# EAGLE design CTS_Teensy_Board_v1_1 (EAGLE 9.4.2)
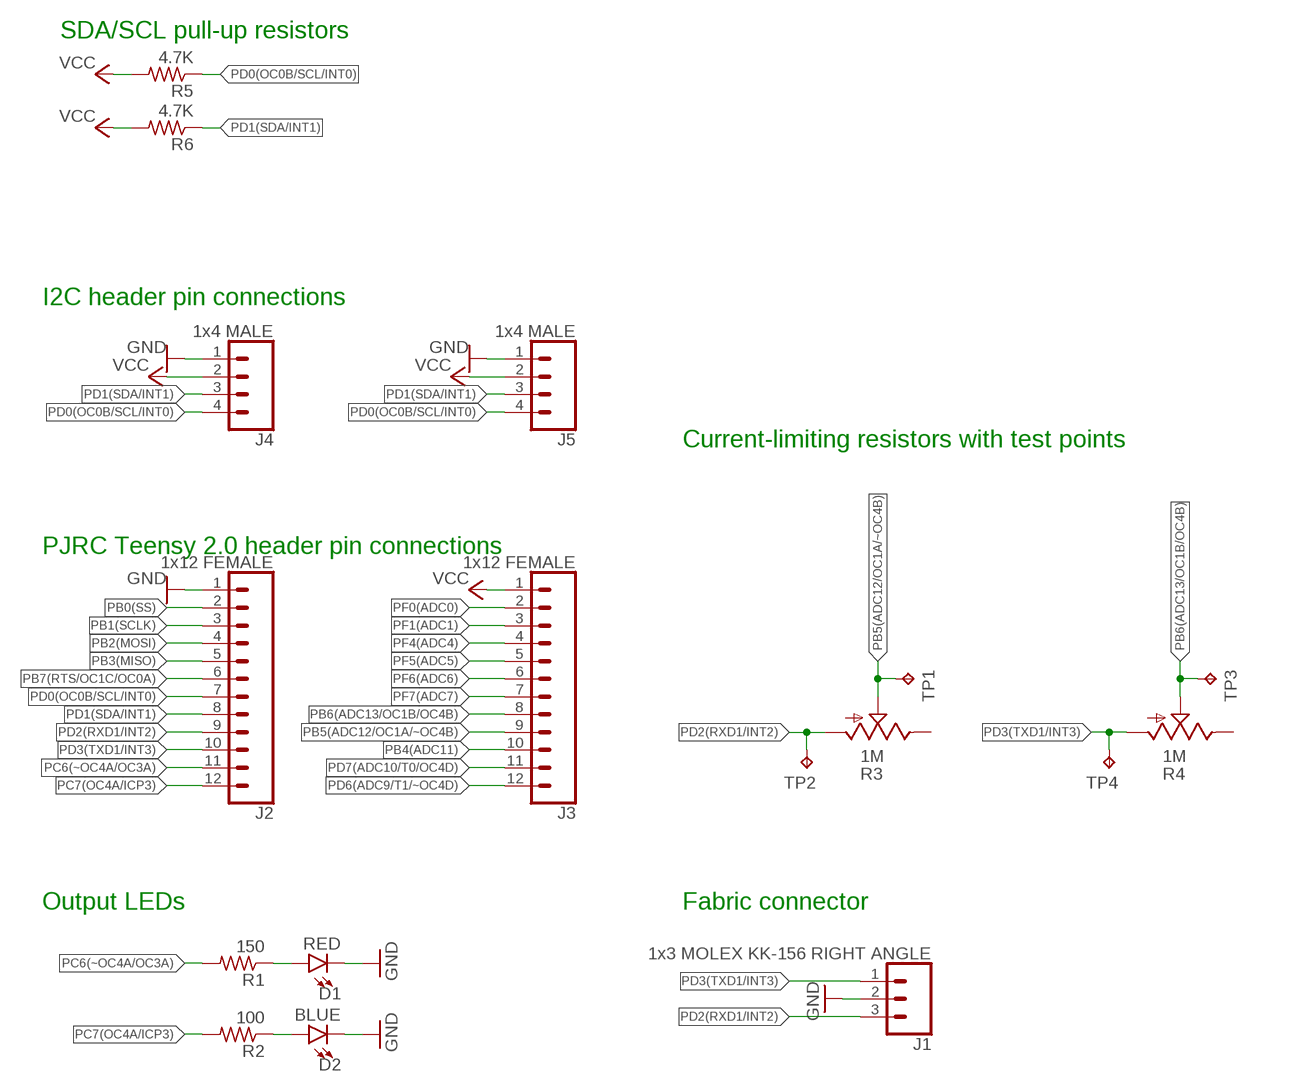
[diagram p0: schematic, sheet 1]

## Parts
D1  RED  LED3MM  [LED_3MM]
D2  BLUE  LED3MM  [LED_3MM]
J1  1x3 MOLEX KK-156 RIGHT ANGLE  CONN_03POLAR  [MOLEX-1X3]
J2  1x12 FEMALE  CONN_12  [1X12]
J3  1x12 FEMALE  CONN_12  [1X12]
J4  1x4 MALE  CONN_04  [1X04]
J5  1x4 MALE  CONN_04  [1X04]
R1  150  R-US_0204/7  [0204/7]
R2  100  R-US_0204/7  [0204/7]
R3  1M  TRIM_US-B90P  [SP19L]
R4  1M  TRIM_US-B90P  [SP19L]
R5  4.7K  R-US_0204/7  [0204/7]
R6  4.7K  R-US_0204/7  [0204/7]
TP1  TPTP18R  [TP18R]
TP2  TPTP18R  [TP18R]
TP3  TPTP18R  [TP18R]
TP4  TPTP18R  [TP18R]

## Nets
GND: D1.K(C) D2.K(C) J1.2 J2.1 J4.1 J5.1
N$31: D2.A R2.1
N$32: D1.A R1.1
PB0(SS): J2.2
PB1(SCLK): J2.3
PB2(MOSI): J2.4
PB3(MISO): J2.5
PB4(ADC11): J3.10
PB5(ADC12/OC1A/~OC4B): J3.9 R3.S TP1.TP
PB6(ADC13/OC1B/OC4B): J3.8 R4.S TP3.TP
PB7(RTS/OC1C/OC0A): J2.6
PC6(~OC4A/OC3A): J2.11 R1.2
PC7(OC4A/ICP3): J2.12 R2.2
PD0(OC0B/SCL/INT0): J2.7 J4.4 J5.4 R5.1
PD1(SDA/INT1): J2.8 J4.3 J5.3 R6.1
PD2(RXD1/INT2): J1.3 J2.9 R3.A TP2.TP
PD3(TXD1/INT3): J1.1 J2.10 R4.A TP4.TP
PD6(ADC9/T1/~OC4D): J3.12
PD7(ADC10/T0/OC4D): J3.11
PF0(ADC0): J3.2
PF1(ADC1): J3.3
PF4(ADC4): J3.4
PF5(ADC5): J3.5
PF6(ADC6): J3.6
PF7(ADC7): J3.7
VCC: J3.1 J4.2 J5.2 R5.2 R6.2
Unconnected: R3.E R4.E

## Notes on the sheet
- SDA/SCL pull-up resistors
- I2C header pin connections
- Current-limiting resistors with test points
- PJRC Teensy 2.0 header pin connections
- Output LEDs | Fabric connector

## Library data of the parts
D1 D2 = SparkFun-LED:LED: LED (Generic) Standard schematic elements and footprints for 5mm, 3mm, 1206, and 0603 sized LEDs. Generic LEDs with no color specified.; PROD_ID: DIO-08794
J1 = SparkFun-Connectors:CONN_03: Multi connection point. Often used as Generic Header-pin footprint for 0.1 inch spaced/style header connections On any of the 0.1 inch spaced packages, you can populate with these: Break Away Headers - Straight <https://www.sparkfun.com/products/116> (PRT-00116) Break Away Male Headers - Right Angle <https://www.sparkfun.com/products/553> (PRT-00553) Female Headers <https://www.sparkfun.com/products/115> (PRT-00115) Break Away Headers - Machine Pin <https://www.sparkfun.com/products/117> (PRT-00117) Break Away Female Headers - Swiss Machine Pin <https://www.sparkfun.com/products/743> (PRT-00743) Stackable Header - 3 Pin (Female, 0.1") <https://www.sparkfun.com/products/13875> (PRT-13875) For SCREWTERMINALS and SPRING TERMINALS visit here: Screw Terimnals on SparkFun.com <https://www.sparkfun.com/search/results?term=Screw+Terminals> (5mm/3.5mm/2.54mm spacing) This device is also useful as a general connection point to wire up your design to another part of your project. Our various solder wires solder well into these plated through hole pads. Hook-Up Wire - Assortment (Stranded, 22 AWG) <https://www.sparkfun.com/products/11375> (PRT-11375) Hook-Up Wire - Assortment (Solid Core, 22 AWG) <https://www.sparkfun.com/products/11367> (PRT-11367) View the entire wire category on our website here <https://www.sparkfun.com/categories/141> Special notes: Molex polarized connector foot print use with SKU : PRT-08232 with associated crimp pins and housings.; PROD_ID: CONN-08625; SF_ID: PRT-08096
J2 J3 = SparkFun-Connectors:CONN_12: Multi connection point. Often used as Generic Header-pin footprint for 0.1 inch spaced/style header connections On any of the 0.1 inch spaced packages, you can populate with these: Break Away Headers - Straight <https://www.sparkfun.com/products/116> (PRT-00116) Break Away Male Headers - Right Angle <https://www.sparkfun.com/products/553> (PRT-00553) Female Headers <https://www.sparkfun.com/products/115> (PRT-00115) Break Away Headers - Machine Pin <https://www.sparkfun.com/products/117> (PRT-00117) Break Away Female Headers - Swiss Machine Pin <https://www.sparkfun.com/products/743> (PRT-00743) For SCREWTERMINALS and SPRING TERMINALS visit here: Screw Terimnals on SparkFun.com <https://www.sparkfun.com/search/results?term=Screw+Terminals> (5mm/3.5mm/2.54mm spacing) This device is also useful as a general connection point to wire up your design to another part of your project. Our various solder wires solder well into these plated through hole pads. Hook-Up Wire - Assortment (Stranded, 22 AWG) <https://www.sparkfun.com/products/11375> (PRT-11375) Hook-Up Wire - Assortment (Solid Core, 22 AWG) <https://www.sparkfun.com/products/11367> (PRT-11367) View the entire wire category on our website here <https://www.sparkfun.com/categories/141> Special notes: Molex polarized connector foot print use with SKU : PRT-08231 with associated crimp pins and housings. 1MM SMD Version SKU: PRT-10208 NOTES ON THE VARIANTS LOCK and LOCK_LONGPADS... This footprint was designed to help hold the alignment of a through-hole component (i.e. 6-pin header) while soldering it into place. You may notice that each hole has been shifted either up or down by 0.005 of an inch from it's more standard position (which is a perfectly straight line). This slight alteration caused the pins (the squares in the middle) to touch the edges of the holes. Because they are alternating, it causes a "brace" to hold the component in place. 0.005 has proven to be the perfect amount of "off-center" position when using our standard breakaway headers. Although looks a little odd when you look at the bare footprint, once you have a header in there, the alteration is very hard to notice. Also,if you push a header all the way into place, it is covered up entirely on the bottom side.
J4 J5 = SparkFun-Connectors:CONN_04: Multi connection point. Often used as Generic Header-pin footprint for 0.1 inch spaced/style header connections On any of the 0.1 inch spaced packages, you can populate with these: Break Away Headers - Straight <https://www.sparkfun.com/products/116> (PRT-00116) Break Away Male Headers - Right Angle <https://www.sparkfun.com/products/553> (PRT-00553) Female Headers <https://www.sparkfun.com/products/115> (PRT-00115) Break Away Headers - Machine Pin <https://www.sparkfun.com/products/117> (PRT-00117) Break Away Female Headers - Swiss Machine Pin <https://www.sparkfun.com/products/743> (PRT-00743) For SCREWTERMINALS and SPRING TERMINALS visit here: Screw Terimnals on SparkFun.com <https://www.sparkfun.com/search/results?term=Screw+Terminals> (5mm/3.5mm/2.54mm spacing) This device is also useful as a general connection point to wire up your design to another part of your project. Our various solder wires solder well into these plated through hole pads. Hook-Up Wire - Assortment (Stranded, 22 AWG) <https://www.sparkfun.com/products/11375> (PRT-11375) Hook-Up Wire - Assortment (Solid Core, 22 AWG) <https://www.sparkfun.com/products/11367> (PRT-11367) View the entire wire category on our website here <https://www.sparkfun.com/categories/141> Special notes: Molex polarized connector foot print use with SKU : PRT-08231 with associated crimp pins and housings. 1MM SMD Version SKU: PRT-10208; PROD_ID: CONN-09696
R1 R2 R5 R6 = adafruit:R-US_: RESISTOR, American symbol
R3 R4 = pot:TRIM_US-: POTENTIOMETER
TP1-TP4 = testpad:TP: Test pad

## Board
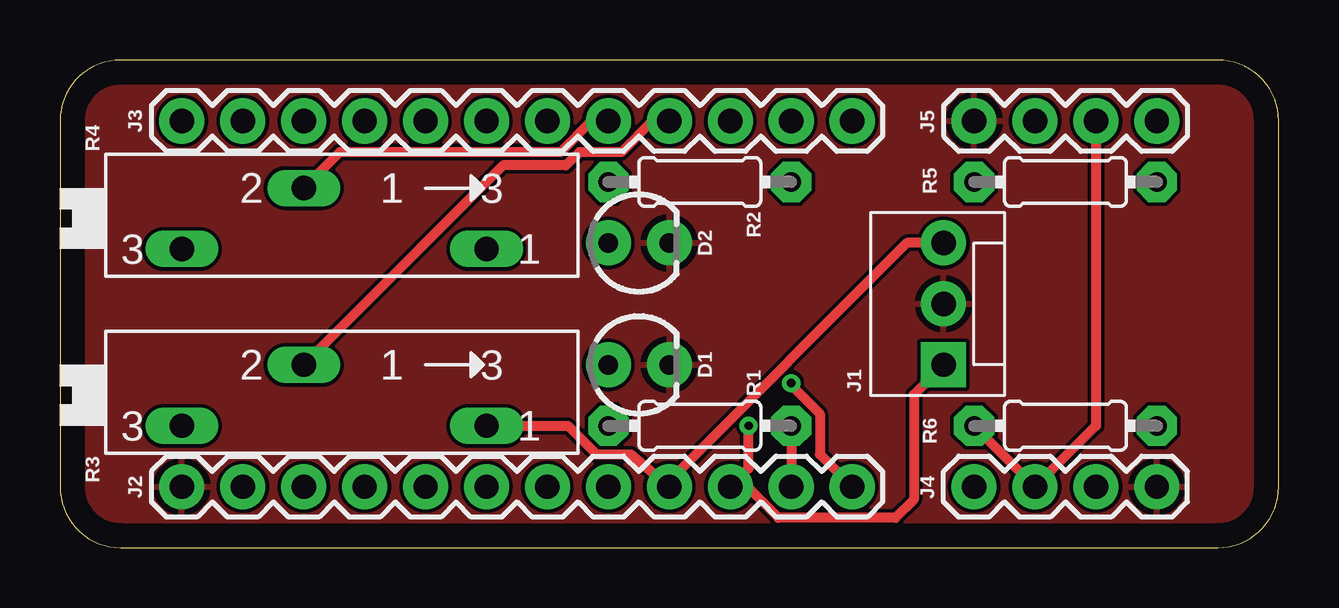
[diagram p1: board, top side]
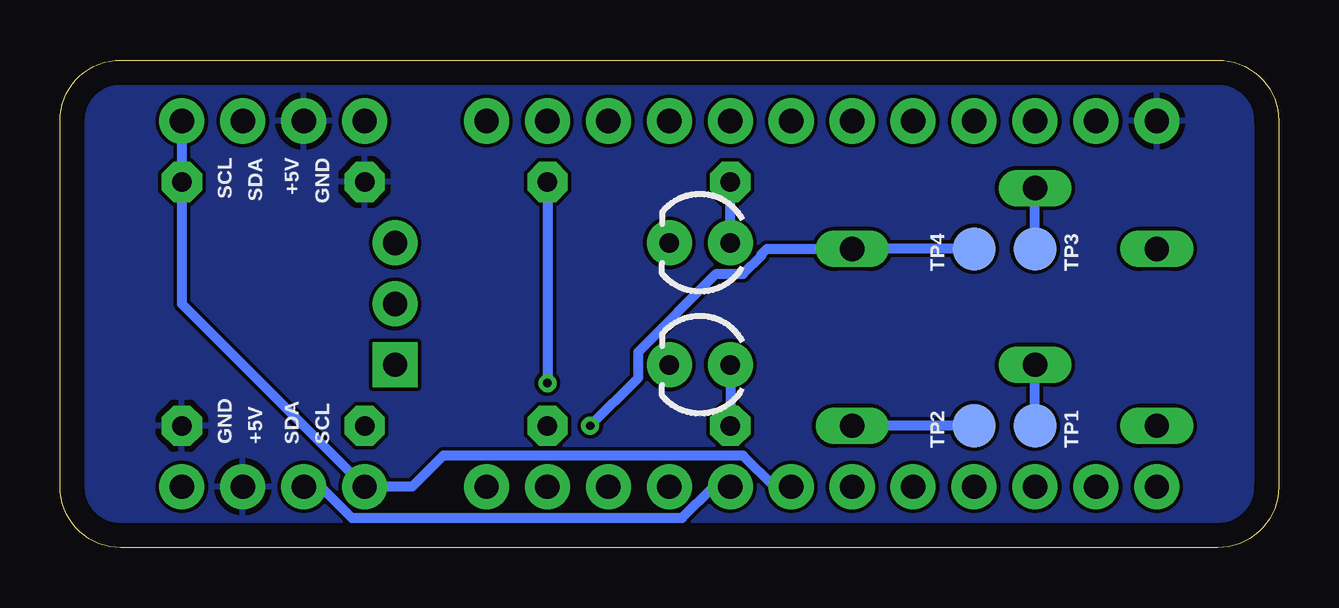
[diagram p2: board, bottom side, seen from below]

Size 50.8 x 20.32 mm. Coordinates in mm from the lower left corner, seen from the top.
Outline: 2.54,0 48.26,0 arc90 50.8,2.54 50.8,17.78 arc90 48.26,20.32 2.54,20.32 arc90 0,17.78 0,2.54 arc90 2.54,0
Copper layers (1*16): Top 0.035mm / dielectric 1.5mm / Bottom 0.035mm
Design rules "default": minimum track width 6mil, minimum drill 0.35mm, track to track 6mil, track to pad 6mil, pad to pad 6mil, via to via 6mil, smd to smd 6mil, copper to edge 40mil, drill to drill 6mil, minimum pad ring 10mil, minimum via ring 8mil, stop-mask expansion 4mil, vias tented up to drill 0mil, thermal gap 10mil

### Footprints (pad centres in the part's own frame; a part is rotated, then mirrored left to right if it is on the bottom)
LED_3MM = drill 0.813 pad 1.88: A -1.27,0; K 1.27,0
MOLEX-1X3 = drill 1.016 pad 1.88 square: 1 0,0 | drill 1.016 pad 1.88: 2 2.54,0; 3 5.08,0
1X12 = drill 1.016 pad 1.88: 1 0,0; 2 2.54,0; 3 5.08,0; 4 7.62,0; 5 10.16,0; 6 12.7,0; 7 15.24,0; 8 17.78,0; 9 20.32,0; 10 22.86,0; 11 25.4,0; 12 27.94,0
1X04 = drill 1.016 pad 1.88: 1 0,0; 2 2.54,0; 3 5.08,0; 4 7.62,0
0204/7 = drill 0.813 pad 1.676 octagon: 1 -3.81,0; 2 3.81,0
SP19L = drill 1.016 long: A 5.715,-1.27; E -6.985,-1.27; S -1.905,1.27
TP18R = smd 1.8 x 1.8: TP 0,0

### Placement (x,y rotation side)
D1  24.13,7.62 0 top
D2  24.13,12.7 0 top
J1  36.83,7.62 90 top
J2  5.08,2.54 0 top
J3  5.08,17.78 0 top
J4  45.72,2.54 180 top
J5  38.1,17.78 0 top
R1  26.67,5.08 0 top
R2  26.67,15.24 0 top
R3  12.06,6.35 0 top
R4  12.06,13.72 0 top
R5  41.91,15.24 180 top
R6  41.91,5.08 0 top
TP1  10.16,5.08 0 bottom
TP2  12.7,5.08 0 bottom
TP3  10.16,12.45 270 bottom
TP4  12.7,12.45 0 bottom

### Tracks (layer width: path | path; a pad name or v marks a point on that pad's centre or on a via)
GND
  pour Top: -2.54,20.32 -2.54,1.27 1.27,-2.54 49.53,-2.54 52.07,0 52.07,20.32 49.53,22.86 0,22.86
N$31
  Bottom 0.406: D2.A R2.1
N$32
  Bottom 0.406: D1.A R1.1
PB5(ADC12/OC1A/~OC4B)
  Top 0.406: R3.S 18.47,15.93 21.09,15.93 21.65,16.48 23.4,16.48 24.69,17.78 J3.9
  Bottom 0.406: TP1.TP R3.S
PB6(ADC13/OC1B/OC4B)
  Top 0.406: J3.8 22.15,17.78 20.86,16.48 11.66,16.48 R4.S
  Bottom 0.406: TP3.TP R4.S
PC6(~OC4A/OC3A)
  Top 0.406: R1.2 J2.11
PC7(OC4A/ICP3)  (via drill 0.35)
  Top 0.406: v30.48,6.86 30.48,6.77 31.67,5.57 31.67,3.89 J2.12
  Bottom 0.406: R2.2 v30.48,6.86
PD0(OC0B/SCL/INT0)
  Bottom 0.406: J5.4 R5.1 45.72,10.16 J4.4 36.12,2.54 34.83,3.83 22.32,3.83 21.03,2.54 J2.7
PD1(SDA/INT1)
  Top 0.406: J5.3 43.18,5.08 J4.3 R6.1
  Bottom 0.406: J4.3 39.93,2.54 38.64,1.25 24.86,1.25 23.57,2.54 J2.8
PD2(RXD1/INT2)
  Top 0.406: J1.3 35.31,12.7 25.4,2.79 J2.9 23.8,3.89 22.37,3.89 21.17,5.08 R3.A
  Bottom 0.406: TP2.TP R3.A
PD3(TXD1/INT3)  (via drill 0.35)
  Top 0.406: J1.1 35.59,6.38 35.59,2 34.83,1.25 29.94,1.25 28.65,2.54 J2.10 28.7,3.3 v28.7,5.08
  Bottom 0.406: v28.7,5.08 26.7,7.09 26.7,8.16 23.45,11.4 22.32,11.4 21.57,12.16 21.57,12.22 21.34,12.45 R4.A TP4.TP
VCC
  pour Bottom: 49.53,22.86 1.27,22.86 -2.54,19.05 -2.54,0 0,-2.54 49.53,-2.54 52.07,0 52.07,20.32

### Text on the board
bNames: GND | +5V | SDA | SCL | SCL | SDA | +5V | GND